# Altium project mytuya.PrjPcb
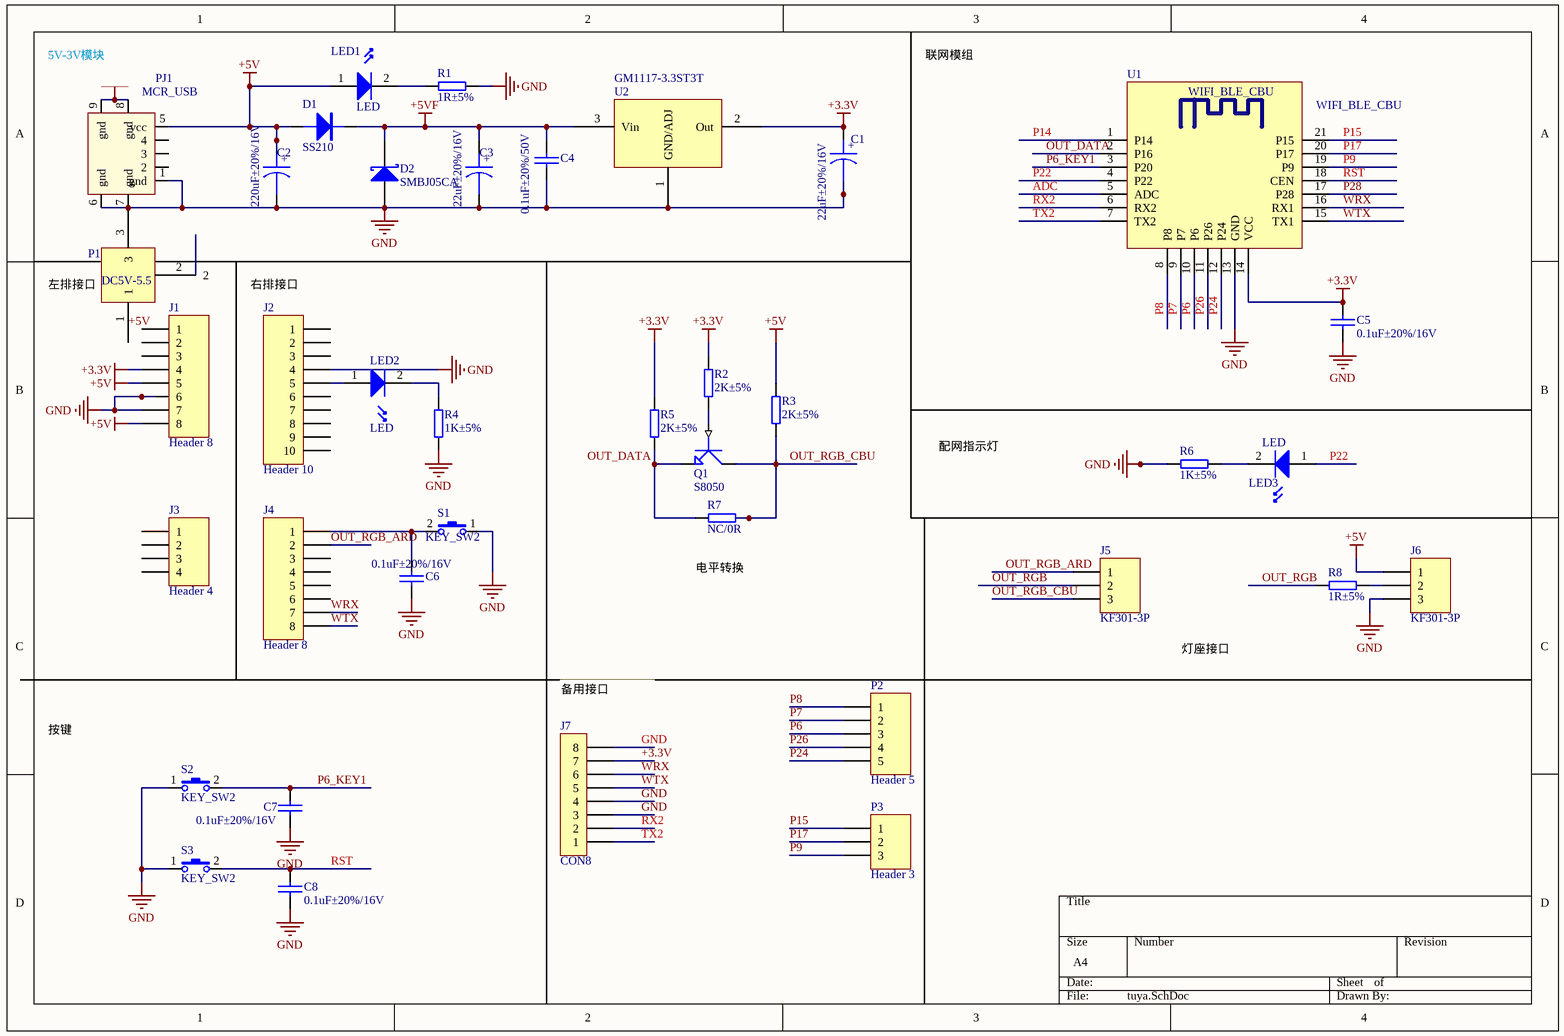
[diagram p0: tuya.SchDoc]
1 sheet, 38 parts. Net scope: global (net labels, ports and power ports of the same name join across sheets).
Board file: tuya.PcbDoc

## Sheet tuya.SchDoc
size A4

### Parts
C1  22uF±20%/16V  [钽电容B3528]
C2  220uF±20%/16V  [CD0.15]
C3  22uF±20%/16V  [钽电容B3528]
C4  0.1uF±20%/50V  [C0603]
C5  0.1uF±20%/16V  [C0603]
C6  0.1uF±20%/16V  [C0603]
C7  0.1uF±20%/16V  [C0603]
C8  0.1uF±20%/16V  [C0603]
D1  SS210  [SMA(DO-214AC)]
D2  SMBJ05CA  [SMB(DO-214AA)]
J1  Header 8  [HDR1X8]
J2  Header 10  [HDR1X10]
J3  Header 4  [HDR1X4]
J4  Header 8  [HDR1X8]
J5  KF301-3P  [HDR1X3]
J6  KF301-3P  [HDR1X3]
J7  CON8  [HDR1X8Z]
LED1  LED  [LED0805_1]
LED2  LED  [LED0805_1]
LED3  LED  [LED0805_1]
P1  DC5V-5.5  [3pin-dc5-x]
P2  Header 5  [HDR1X5]
P3  Header 3  [HDR1X3]
PJ1  MCR_USB  [MICRO_USB-NEW-16.12.12]
Q1  S8050  [SOT-23-NPN]
R1  1R±5%  [R0603]
R2  2K±5%  [R0603]
R3  2K±5%  [R0603]
R4  1K±5%  [R0603]
R5  2K±5%  [R0603]
R6  1K±5%  [R0603]
R7  NC/0R  [R0603]
R8  1R±5%  [R0603]
S1  KEY_SW2  [KEY4-SMD]
S2  KEY_SW2  [KEY4-SMD]
S3  KEY_SW2  [KEY4-SMD]
U1  WIFI_BLE_CBU  [WIFI_BLE_CBU]
U2  GM1117-3.3ST3T  [SOT-223]

### Nets
+3.3V: C1.1 C5.2 J1.4 J7.7 R2.1 R5.1 U1.14(VCC) U2.2(Out)
+5V: C2.1 D1.1 J1.5 J1.8 J6.1 LED1.1 PJ1.5(vcc) R3.1
+5VF: C3.1 C4.1 D1.2 D2.2(K) U2.3(Vin)
GND: C1.2 C2.2 C3.2 C4.2 C5.1 C6.1 C7.1 C8.2 D2.1(A) J1.6 J1.7 J2.4 J6.3 J7.3 J7.4 J7.8 P1.3 PJ1.1(gnd) PJ1.6(gnd) PJ1.7(gnd) PJ1.8(gnd) PJ1.9(gnd) R1.2 R4.1 R6.2 S1.1 S2.1 S3.1 U1.13(GND) U2.1(GND/ADJ)
ADC: U1.5(ADC)
OUT_DATA: U1.2(P16)
OUT_RGB: J5.2 R8.1
OUT_RGB_ARD: J4.2 J5.1
OUT_RGB_CBU: J5.3 Q1.3(C) R3.2 R7.2
P6: P2.3 U1.10(P6)
P6_KEY1: C7.2 S2.2 U1.3(P20)
P7: P2.2 U1.9(P7)
P8: P2.1 U1.8(P8)
P9: P3.3 U1.19(P9)
P14: U1.1(P14)
P15: P3.1 U1.21(P15)
P17: P3.2 U1.20(P17)
P22: LED3.1 U1.4(P22)
P24: P2.5 U1.12(P24)
P26: P2.4 U1.11(P26)
P28: U1.17(P28)
RST: C8.1 S3.2 U1.18(CEN)
RX2: J7.2 U1.6(RX2)
TX2: J7.1 U1.7(TX2)
WRX: J4.7 J7.6 U1.16(RX1)
WTX: J4.8 J7.5 U1.15(TX1)
NetC6_2: C6.2 J4.1 S1.2
NetJ2_5: J2.5 LED2.1
NetJ6_2: J6.2 R8.2
NetLED1_2: LED1.2 R1.1
NetLED2_2: LED2.2 R4.2
NetLED3_2: LED3.2 R6.1
NetQ1_1: Q1.1(E) R5.2 R7.1
NetQ1_2: Q1.2(B) R2.2

Not connected (* = marked no-connect by the designer): J1 1 2 3; J2 1 2 3 6 7 8 9 10; J3 1 2 3 4; J4 3 4 5 6; P1 1 2; PJ1 2 3 4

### Notes on the sheet
- (near PJ1) 5V-3V模块
- 联网模组
- (near P1) 左排接口
- (near J2) 右排接口
- 配网指示灯
- (near R7) 电平转换
- (near J7) 备用接口
- 灯座接口
- 按键
- Labels drawn without touching a wire or pin: +5V, OUT_DATA
- (in symbol CAPACITOR POL) +

### Library data of the parts
C1-C3 = CAPACITOR POL: Capacitor
C4-C8 = CAP: Capacitor
D1 = Diode1: Diode
D2 = D Schottky: Schottky Diode; MFR: Toshiba
J1 J4 = Header 8: Header, 8-Pin; LatestRevisionDate: 17-Jul-2002; LatestRevisionNote: Re-released for DXP Platform.; Publisher: Altium Limited
J2 = Header 10: Header, 10-Pin; LatestRevisionDate: 17-Jul-2002; LatestRevisionNote: Re-released for DXP Platform.; Publisher: Altium Limited
J3 = Header 4: Header, 4-Pin; LatestRevisionDate: 17-Jul-2002; LatestRevisionNote: Re-released for DXP Platform.; Publisher: Altium Limited
J5 J6 P3 = Header 3: Header, 3-Pin; LatestRevisionDate: 17-Jul-2002; LatestRevisionNote: Re-released for DXP Platform.; Publisher: Altium Limited
J7 = CON8: Connector
P2 = Header 5: Header, 5-Pin; LatestRevisionDate: 17-Jul-2002; LatestRevisionNote: Re-released for DXP Platform.; Publisher: Altium Limited
Q1 = NPN: NPN Transistor
R1-R8 = RES5
U1 = WIFI_BLE_CBU: Module
U2 = GM1117
LED1-LED3 = LED: Published: *; LatestRevisionDate: *; LatestRevisionNote: *; DatasheetDocument: *; PackageDocument: *; PackageReference: *; Publisher: *; ComponentLink1Description: *; ComponentLink1URL: *; Code_JEDEC: *
PJ1 = MCR_USB: Published: *; Revision 1: *; Revision 2: *; Datasheet: *; Publisher: *